# Altium project PCB_WMR_Project.PrjPcb
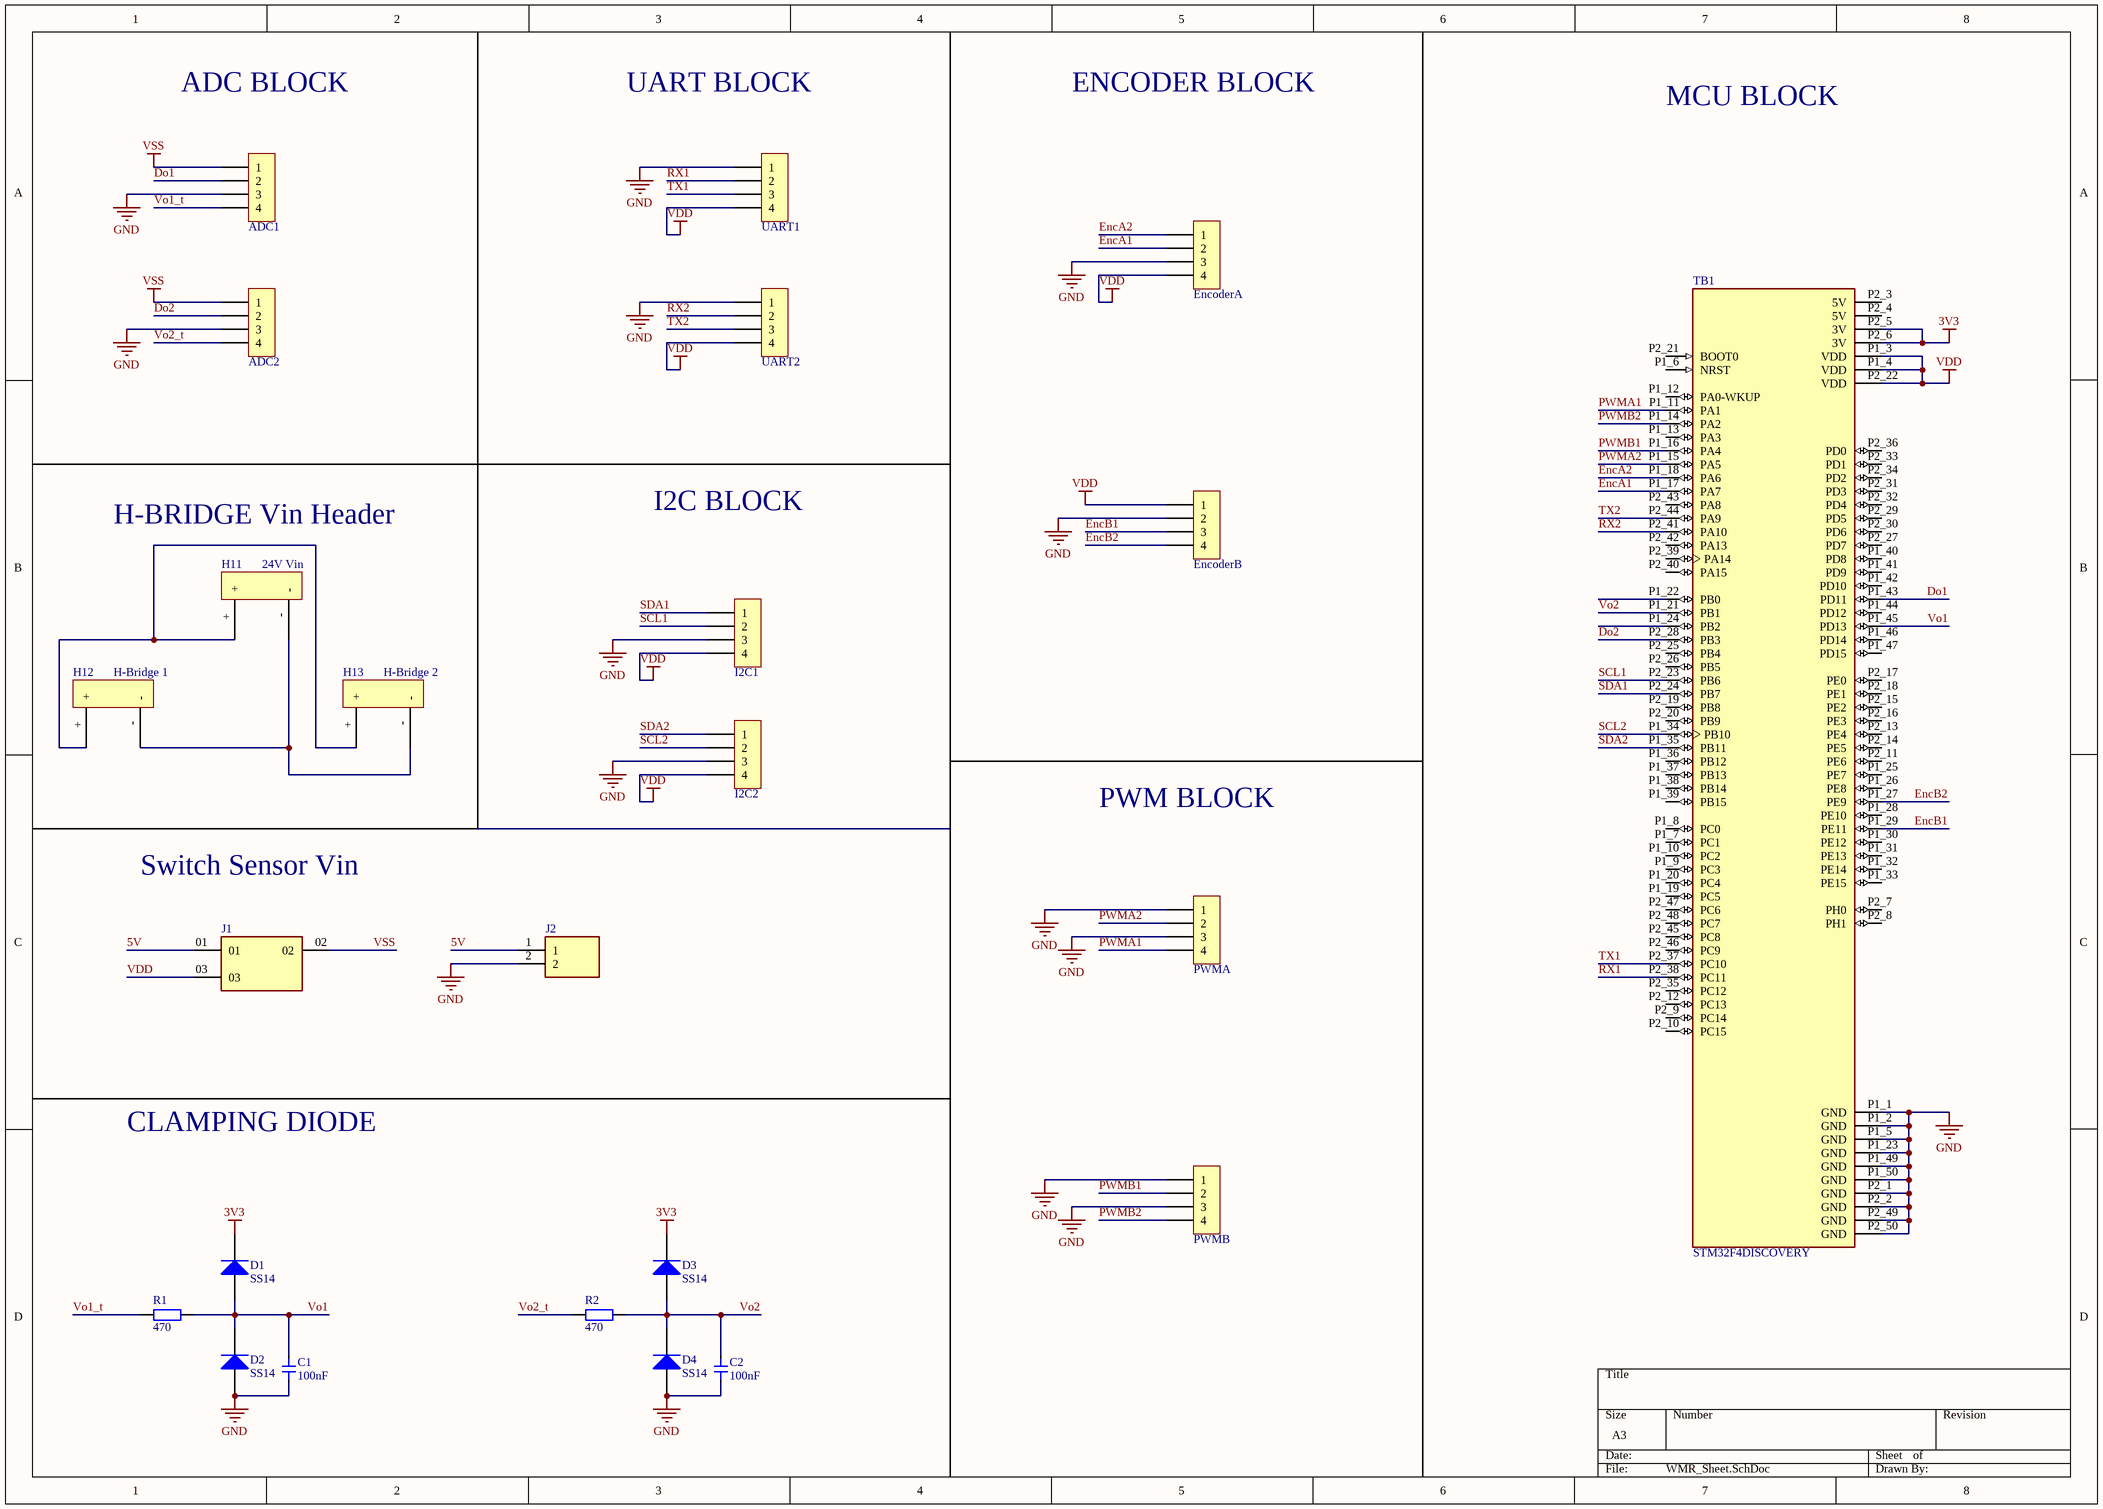
[diagram p0: WMR_Sheet.SchDoc]
1 sheet, 24 parts. Net scope: global (net labels, ports and power ports of the same name join across sheets).
Board file: WMR_PCB.PcbDoc

## Sheet WMR_Sheet.SchDoc
size A3; SheetNumber: 1; SheetTotal: 1

### Parts
C1  100nF  [Cap 1206]
C2  100nF  [Cap 1206]
D1  SS14  [DIODE SMA]
D2  SS14  [DIODE SMA]
D3  SS14  [DIODE SMA]
D4  SS14  [DIODE SMA]
H1  EncoderA  [XH2.54M-4]
H2  EncoderB  [XH2.54M-4]
H3  PWMA  [XH2.54M-4]
H4  PWMB  [XH2.54M-4]
H5  UART1  [XH2.54M-4]
H6  UART2  [XH2.54M-4]
H7  I2C1  [XH2.54M-4]
H8  I2C2  [XH2.54M-4]
H9  ADC1  [XH2.54M-4]
H10  ADC2  [XH2.54M-4]
H11  24V Vin  [barrier_terminal]
H12  H-Bridge 1  [barrier_terminal]
H13  H-Bridge 2  [barrier_terminal]
J1  (no value)  [SAMTEC_TSW-101-07-G-T-LL]
J2  (no value)  [MULTICOMP_MC000048]
R1  470  [tro smd 1206]
R2  470  [tro smd 1206]
TB1  STM32F4DISCOVERY  [MODULE_STM32F4DISCOVERY]

### Nets
3V3: D1.2(K) D3.2(K) TB1.P2_5(3V) TB1.P2_6(3V)
GND: C1.2 C2.2 D2.1(A) D4.1(A) H1.3 H2.2 H3.1 H3.3 H4.1 H4.3 H5.1 H6.1 H7.3 H8.3 H9.3 H10.3 J2.2 TB1.P1_1(GND) TB1.P1_2(GND) TB1.P1_5(GND) TB1.P1_23(GND) TB1.P1_49(GND) TB1.P1_50(GND) TB1.P2_1(GND) TB1.P2_2(GND) TB1.P2_49(GND) TB1.P2_50(GND)
VDD: H1.4 H2.1 H5.4 H6.4 H7.4 H8.4 J1.03 TB1.P1_3(VDD) TB1.P1_4(VDD) TB1.P2_22(VDD)
VSS: H9.1 H10.1 J1.02
5V: J1.01 J2.1
Do1: H9.2 TB1.P1_43(PD11)
Do2: H10.2 TB1.P2_28(PB3)
EncA1: H1.2 TB1.P1_17(PA7)
EncA2: H1.1 TB1.P1_18(PA6)
EncB1: H2.3 TB1.P1_29(PE11)
EncB2: H2.4 TB1.P1_27(PE9)
PWMA1: H3.4 TB1.P1_11(PA1)
PWMA2: H3.2 TB1.P1_15(PA5)
PWMB1: H4.2 TB1.P1_16(PA4)
PWMB2: H4.4 TB1.P1_14(PA2)
RX1: H5.2 TB1.P2_38(PC11)
RX2: H6.2 TB1.P2_41(PA10)
SCL1: H7.2 TB1.P2_23(PB6)
SCL2: H8.2 TB1.P1_34(PB10)
SDA1: H7.1 TB1.P2_24(PB7)
SDA2: H8.1 TB1.P1_35(PB11)
TX1: H5.3 TB1.P2_37(PC10)
TX2: H6.3 TB1.P2_44(PA9)
Vo1: C1.1 D1.1(A) D2.2(K) R1.2 TB1.P1_45(PD13)
Vo1_t: H9.4 R1.1
Vo2: C2.1 D3.1(A) D4.2(K) R2.2 TB1.P1_21(PB1)
Vo2_t: H10.4 R2.1
NetH11_+: H11.+ H12.+ H13.+
NetH11_-: H11.- H12.- H13.-

Not connected (* = marked no-connect by the designer): TB1 P1_6(NRST) P1_7(PC1) P1_8(PC0) P1_9(PC3) P1_10(PC2) P1_12(PA0-WKUP) P1_13(PA3) P1_19(PC5) P1_20(PC4) P1_22(PB0) P1_24(PB2) P1_25(PE7) P1_26(PE8) P1_28(PE10) P1_30(PE12) P1_31(PE13) P1_32(PE14) P1_33(PE15) P1_36(PB12) P1_37(PB13) P1_38(PB14) P1_39(PB15) P1_40(PD8) P1_41(PD9) P1_42(PD10) P1_44(PD12) P1_46(PD14) P1_47(PD15) P2_3(5V) P2_4(5V) P2_7(PH0) P2_8(PH1) P2_9(PC14) P2_10(PC15) P2_11(PE6) P2_12(PC13) P2_13(PE4) P2_14(PE5) P2_15(PE2) P2_16(PE3) P2_17(PE0) P2_18(PE1) P2_19(PB8) P2_20(PB9) P2_21(BOOT0) P2_25(PB4) P2_26(PB5) P2_27(PD7) P2_29(PD5) P2_30(PD6) P2_31(PD3) P2_32(PD4) P2_33(PD1) P2_34(PD2) P2_35(PC12) P2_36(PD0) P2_39(PA14) P2_40(PA15) P2_42(PA13) P2_43(PA8) P2_45(PC8) P2_46(PC9) P2_47(PC6) P2_48(PC7)

### Notes on the sheet
- ADC BLOCK
- UART BLOCK
- ENCODER BLOCK
- MCU BLOCK
- I2C BLOCK
- H-BRIDGE Vin Header
- PWM BLOCK
- Switch Sensor Vin
- CLAMPING DIODE

### Library data of the parts
C1 C2 = Cap 1206: Capacitor SMD 1206
D1-D4 = Diode SS14 ( 1N5819): Dán; Ma_Hang: MH002211; Don_Vi: Con; Ten_Linh_Kien: Diode SS14 DO214 Schottky 1A 40V ( 1N5819 DO214); Chung_Loai: Dán; Ghi_Chu: *; Kieu_Chan: *
H1-H10 = Header 4P 2.54 Duc Thang: Cắm; Ten_Linh_Kien: Header 4P XH2.54-4P Đực Thẳng; Don_Vi: Con; Ma_Hang: MH001285; Chung_Loai: Cắm
H11-H13 = Barrier Terminal
J1 = TSW-101-07-G-T-LL: Package: None; Price: None; Value: *; MP: TSW-101-07-G-T-LL; Availability: Unavailable
J2 = MC000048: TERMINAL BLOCK, PCB, 2WAY, 26-12AWG; Connector Type: PCB Terminal Block; Connector Mounting: PCB; Pitch Spacing: 5.08...; MF: Multicomp; SnapEDA_Link: https://www.snapeda.com/parts/MC000048/Multicomp/view-part/?ref=snap; Package: None; Value: *; MP: MC000048; Check_prices: https://www.snapeda.com/parts/MC000048/Multicomp/view-part/?ref=eda
R1 R2 = Tro 1206 1% 470k: Dán; Don_Vi: Con; Ten_Linh_Kien: Trở 1206 5% 470k; So_Chan: 2; Ma_Hang: MH005899; Chung_Loai: Dán; Kieu_Chan: *
TB1 = STM32F4DISCOVERY: Development kit: ARM ST; pin strips, pin header; No.of; Availability: Unavailable; MP: STM32F4DISCOVERY; Value: *; Price: None; Package: None